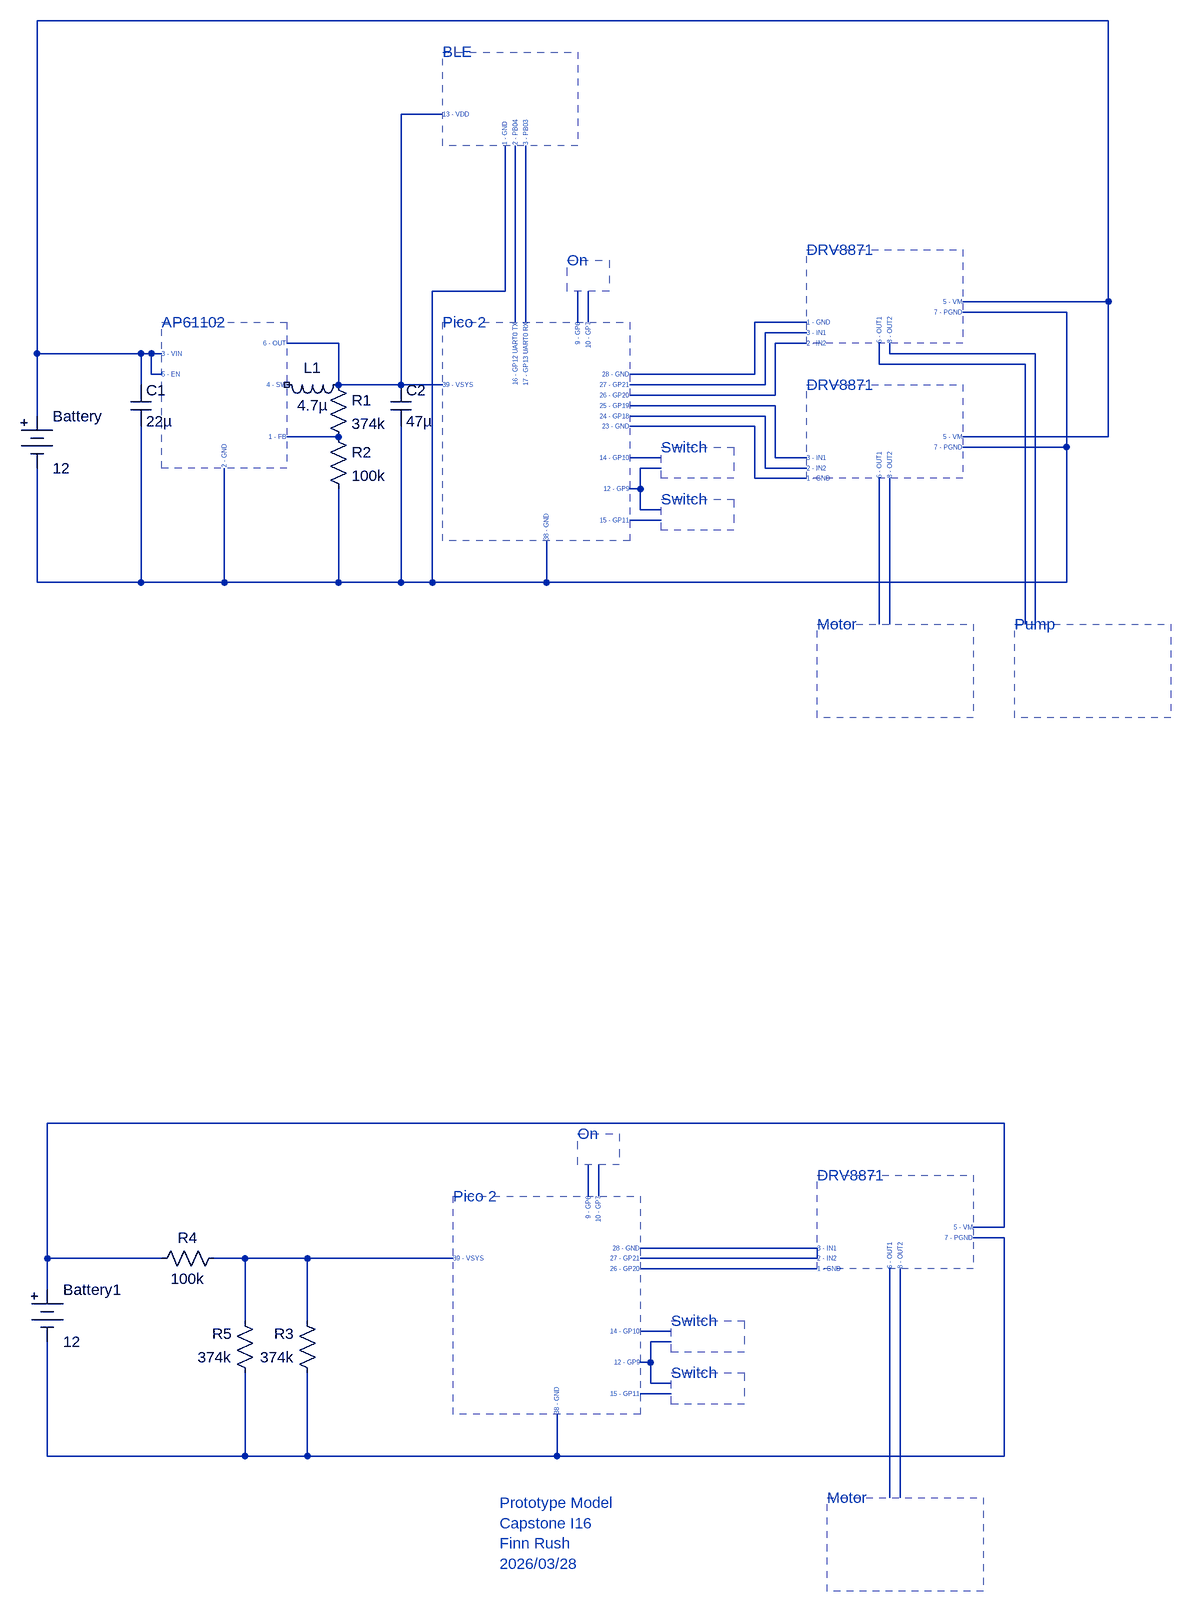
[diagram p0: schematic Sprayer model.asc]
Sprayer model.asc, the LTspice schematic file:
Version 4.1
SHEET 1 1812 1940
WIRE 1696 -480 48 -480
WIRE 672 -336 608 -336
WIRE 768 -64 768 -288
WIRE 768 -64 656 -64
WIRE 1696 -48 1696 -480
WIRE 1696 -48 1472 -48
WIRE 1632 -32 1472 -32
WIRE 784 -16 784 -288
WIRE 800 -16 800 -288
WIRE 880 -16 880 -64
WIRE 896 -16 896 -64
WIRE 1232 -16 1152 -16
WIRE 1232 0 1168 0
WIRE 512 16 432 16
WIRE 1232 16 1184 16
WIRE 48 32 48 -480
WIRE 208 32 48 32
WIRE 224 32 208 32
WIRE 240 32 224 32
WIRE 1360 32 1360 16
WIRE 1584 32 1360 32
WIRE 1344 48 1344 16
WIRE 1568 48 1344 48
WIRE 224 64 224 32
WIRE 240 64 224 64
WIRE 1152 64 1152 -16
WIRE 1152 64 960 64
WIRE 208 80 208 32
WIRE 512 80 512 16
WIRE 608 80 608 -336
WIRE 608 80 512 80
WIRE 672 80 608 80
WIRE 1168 80 1168 0
WIRE 1168 80 960 80
WIRE 1184 96 1184 16
WIRE 1184 96 960 96
WIRE 1184 112 960 112
WIRE 48 128 48 32
WIRE 1168 128 960 128
WIRE 1152 144 960 144
WIRE 512 160 432 160
WIRE 1696 160 1696 -48
WIRE 1696 160 1472 160
WIRE 1632 176 1632 -32
WIRE 1632 176 1472 176
WIRE 1008 192 960 192
WIRE 1184 192 1184 112
WIRE 1232 192 1184 192
WIRE 1008 208 976 208
WIRE 1168 208 1168 128
WIRE 1232 208 1168 208
WIRE 1152 224 1152 144
WIRE 1232 224 1152 224
WIRE 976 240 976 208
WIRE 976 240 960 240
WIRE 976 272 976 240
WIRE 1008 272 976 272
WIRE 1008 288 960 288
WIRE 48 384 48 208
WIRE 208 384 208 144
WIRE 208 384 48 384
WIRE 336 384 336 208
WIRE 336 384 208 384
WIRE 512 384 512 240
WIRE 512 384 336 384
WIRE 608 384 608 144
WIRE 608 384 512 384
WIRE 656 384 656 -64
WIRE 656 384 608 384
WIRE 832 384 832 320
WIRE 832 384 656 384
WIRE 1632 384 1632 176
WIRE 1632 384 832 384
WIRE 1344 448 1344 224
WIRE 1360 448 1360 224
WIRE 1568 448 1568 48
WIRE 1584 448 1584 32
WIRE 1536 1216 64 1216
WIRE 896 1328 896 1280
WIRE 912 1328 912 1280
WIRE 1536 1376 1536 1216
WIRE 1536 1376 1488 1376
WIRE 1536 1392 1488 1392
WIRE 1248 1408 976 1408
WIRE 64 1424 64 1216
WIRE 240 1424 64 1424
WIRE 368 1424 320 1424
WIRE 464 1424 368 1424
WIRE 688 1424 464 1424
WIRE 1248 1424 1248 1408
WIRE 1248 1424 976 1424
WIRE 1248 1440 976 1440
WIRE 64 1472 64 1424
WIRE 368 1520 368 1424
WIRE 464 1520 464 1424
WIRE 1024 1536 976 1536
WIRE 1024 1552 992 1552
WIRE 992 1584 992 1552
WIRE 992 1584 976 1584
WIRE 992 1616 992 1584
WIRE 1024 1616 992 1616
WIRE 1024 1632 976 1632
WIRE 64 1728 64 1552
WIRE 368 1728 368 1600
WIRE 368 1728 64 1728
WIRE 464 1728 464 1600
WIRE 464 1728 368 1728
WIRE 848 1728 848 1664
WIRE 848 1728 464 1728
WIRE 1536 1728 1536 1392
WIRE 1536 1728 848 1728
WIRE 1360 1792 1360 1440
WIRE 1376 1792 1376 1440
SYMBOL Misc\\battery 48 112 R0
WINDOW 123 0 0 Left 0
WINDOW 39 0 0 Left 0
SYMATTR InstName Battery
SYMATTR Value 12
SYMBOL ind 528 64 R90
WINDOW 0 5 56 VBottom 2
WINDOW 3 32 56 VTop 2
SYMATTR InstName L1
SYMATTR Value 4.7µ
SYMATTR SpiceLine Rser=1m
SYMBOL cap 192 80 R0
SYMATTR InstName C1
SYMATTR Value 22µ
SYMBOL cap 592 80 R0
SYMATTR InstName C2
SYMATTR Value 47µ
SYMBOL res 496 64 R0
SYMATTR InstName R1
SYMATTR Value 374k
SYMBOL res 496 144 R0
SYMATTR InstName R2
SYMATTR Value 100k
SYMBOL Misc\\battery 64 1456 R0
WINDOW 123 0 0 Left 0
WINDOW 39 0 0 Left 0
SYMATTR InstName Battery1
SYMATTR Value 12
SYMBOL res 480 1616 R180
WINDOW 0 36 76 Left 2
WINDOW 3 36 40 Left 2
SYMATTR InstName R3
SYMATTR Value 374k
SYMBOL res 336 1408 R90
WINDOW 0 0 56 VBottom 2
WINDOW 3 32 56 VTop 2
SYMATTR InstName R4
SYMATTR Value 100k
SYMBOL res 384 1616 R180
WINDOW 0 36 76 Left 2
WINDOW 3 36 40 Left 2
SYMATTR InstName R5
SYMATTR Value 374k
TEXT 672 -16 Left 2 ;Pico 2
TEXT 240 -16 Left 2 ;AP61102
TEXT 1232 80 Left 2 ;DRV8871
TEXT 1552 448 Left 2 ;Pump
TEXT 1248 448 Left 2 ;Motor
TEXT 672 -432 Left 2 ;BLE
TEXT 672 80 Left 0 ;39 - VSYS
TEXT 784 -16 VRight 0 ;16 - GP12 UART0 TX
TEXT 800 -16 VRight 0 ;17 - GP13 UART0 RX
TEXT 832 320 VLeft 0 ;38 - GND
TEXT 960 80 Right 0 ;27 - GP21
TEXT 960 96 Right 0 ;26 - GP20
TEXT 1008 176 Left 2 ;Switch
TEXT 1008 256 Left 2 ;Switch
TEXT 960 128 Right 0 ;24 - GP18
TEXT 960 288 Right 0 ;15 - GP11
TEXT 960 192 Right 0 ;14 - GP10
TEXT 960 112 Right 0 ;25 - GP19
TEXT 240 32 Left 0 ;3 - VIN
TEXT 240 64 Left 0 ;5 - EN
TEXT 432 16 Right 0 ;6 - OUT
TEXT 432 80 Right 0 ;4 - SW
TEXT 432 160 Right 0 ;1 - FB
TEXT 336 208 VLeft 0 ;2 - GND
TEXT 1472 160 Right 0 ;5 - VM
TEXT 960 64 Right 0 ;28 - GND
TEXT 960 144 Right 0 ;23 - GND
TEXT 960 240 Right 0 ;12 - GP9
TEXT 1472 176 Right 0 ;7 - PGND
TEXT 1344 224 VLeft 0 ;6 - OUT1
TEXT 1360 224 VLeft 0 ;8 - OUT2
TEXT 1232 224 Left 0 ;1 - GND
TEXT 1232 192 Left 0 ;3 - IN1
TEXT 1232 208 Left 0 ;2 - IN2
TEXT 1232 -128 Left 2 ;DRV8871
TEXT 1472 -48 Right 0 ;5 - VM
TEXT 1472 -32 Right 0 ;7 - PGND
TEXT 1344 16 VLeft 0 ;6 - OUT1
TEXT 1360 16 VLeft 0 ;8 - OUT2
TEXT 1232 -16 Left 0 ;1 - GND
TEXT 1232 0 Left 0 ;3 - IN1
TEXT 1232 16 Left 0 ;2 - IN2
TEXT 768 -288 VLeft 0 ;1 - GND
TEXT 672 -336 Left 0 ;13 - VDD
TEXT 784 -288 VLeft 0 ;2 - PB04
TEXT 800 -288 VLeft 0 ;3 - PB03
TEXT 864 -112 Left 2 ;On
TEXT 880 -16 VRight 0 ;9 - GP6
TEXT 896 -16 VRight 0 ;10 - GP7
TEXT 688 1328 Left 2 ;Pico 2
TEXT 1248 1296 Left 2 ;DRV8871
TEXT 1264 1792 Left 2 ;Motor
TEXT 688 1424 Left 0 ;39 - VSYS
TEXT 848 1664 VLeft 0 ;38 - GND
TEXT 976 1424 Right 0 ;27 - GP21
TEXT 976 1440 Right 0 ;26 - GP20
TEXT 1024 1520 Left 2 ;Switch
TEXT 1024 1600 Left 2 ;Switch
TEXT 976 1632 Right 0 ;15 - GP11
TEXT 976 1536 Right 0 ;14 - GP10
TEXT 1488 1376 Right 0 ;5 - VM
TEXT 976 1408 Right 0 ;28 - GND
TEXT 976 1584 Right 0 ;12 - GP9
TEXT 1488 1392 Right 0 ;7 - PGND
TEXT 1360 1440 VLeft 0 ;6 - OUT1
TEXT 1376 1440 VLeft 0 ;8 - OUT2
TEXT 1248 1440 Left 0 ;1 - GND
TEXT 1248 1408 Left 0 ;3 - IN1
TEXT 1248 1424 Left 0 ;2 - IN2
TEXT 880 1232 Left 2 ;On
TEXT 896 1328 VRight 0 ;9 - GP6
TEXT 912 1328 VRight 0 ;10 - GP7
TEXT 760 1800 Left 2 ;Prototype Model\nCapstone I16\nFinn Rush\n2026/03/28
RECTANGLE Normal 960 320 672 -16 2
RECTANGLE Normal 432 208 240 -16 2
RECTANGLE Normal 1472 224 1232 80 2
RECTANGLE Normal 1792 592 1552 448 2
RECTANGLE Normal 1488 592 1248 448 2
RECTANGLE Normal 880 -288 672 -432 2
RECTANGLE Normal 1120 224 1008 176 2
RECTANGLE Normal 1120 304 1008 256 2
RECTANGLE Normal 1472 16 1232 -128 2
RECTANGLE Normal 928 -64 864 -112 2
RECTANGLE Normal 976 1664 688 1328 2
RECTANGLE Normal 1488 1440 1248 1296 2
RECTANGLE Normal 1504 1936 1264 1792 2
RECTANGLE Normal 1136 1568 1024 1520 2
RECTANGLE Normal 1136 1648 1024 1600 2
RECTANGLE Normal 944 1280 880 1232 2

The netlist it stands for:
* Sprayer model.asc
V§Battery N001 N003 12
L1 N002 NC_01 4.7µ Rser=1m
C1 N001 N003 22µ
C2 N002 N003 47µ
R1 N002 N016 374k
R2 N016 N003 100k
V§Battery1 N022 N025 12
R3 N025 N027 374k
R4 N027 N022 100k
R5 N025 N027 374k
* Pico 2
* AP61102
* DRV8871
* Pump
* Motor
* BLE
* 39 - VSYS
* 16 - GP12 UART0 TX
* 17 - GP13 UART0 RX
* 38 - GND
* 27 - GP21
* 26 - GP20
* Switch
* Switch
* 24 - GP18
* 15 - GP11
* 14 - GP10
* 25 - GP19
* 3 - VIN
* 5 - EN
* 6 - OUT
* 4 - SW
* 1 - FB
* 2 - GND
* 5 - VM
* 28 - GND
* 23 - GND
* 12 - GP9
* 7 - PGND
* 6 - OUT1
* 8 - OUT2
* 1 - GND
* 3 - IN1
* 2 - IN2
* DRV8871
* 5 - VM
* 7 - PGND
* 6 - OUT1
* 8 - OUT2
* 1 - GND
* 3 - IN1
* 2 - IN2
* 1 - GND
* 13 - VDD
* 2 - PB04
* 3 - PB03
* On
* 9 - GP6
* 10 - GP7
* Pico 2
* DRV8871
* Motor
* 39 - VSYS
* 38 - GND
* 27 - GP21
* 26 - GP20
* Switch
* Switch
* 15 - GP11
* 14 - GP10
* 5 - VM
* 28 - GND
* 12 - GP9
* 7 - PGND
* 6 - OUT1
* 8 - OUT2
* 1 - GND
* 3 - IN1
* 2 - IN2
* On
* 9 - GP6
* 10 - GP7
* Prototype Model
* Capstone I16
* Finn Rush
* 2026/03/28
.backanno
.end